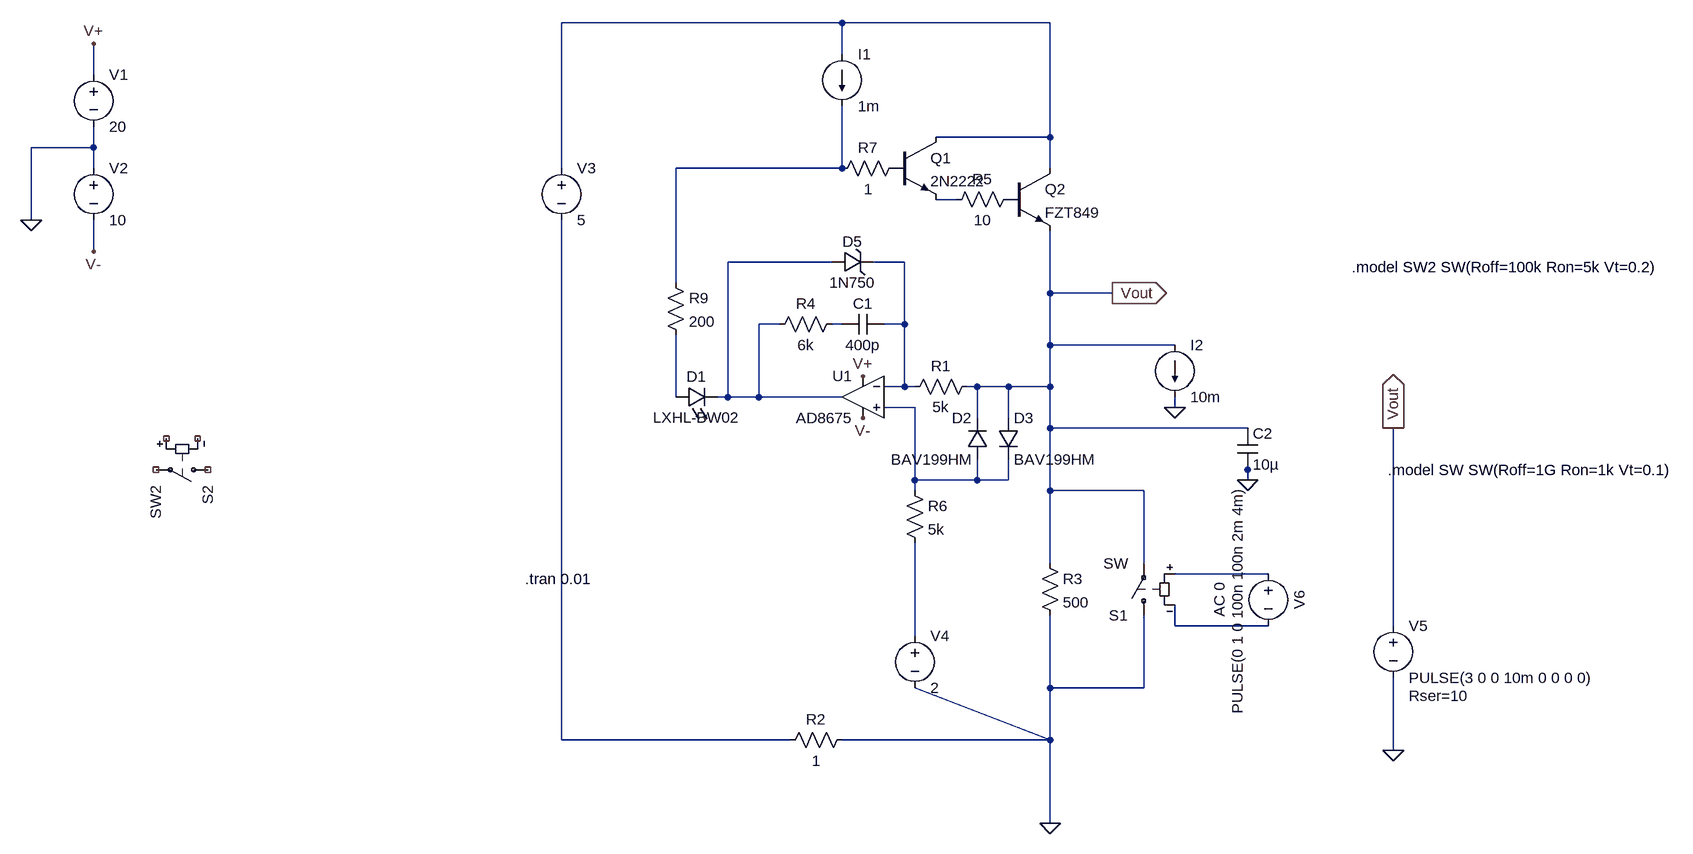
[diagram p0: schematic my_design_from_scratch_test_cv_only.asc]
my_design_from_scratch_test_cv_only.asc, the LTspice schematic file:
Version 4
SHEET 1 1588 1284
WIRE 256 32 -176 32
WIRE 576 32 256 32
WIRE 256 80 256 32
WIRE -896 112 -896 64
WIRE 576 208 576 32
WIRE 576 208 400 208
WIRE -896 224 -896 192
WIRE -896 224 -992 224
WIRE -896 256 -896 224
WIRE -176 256 -176 32
WIRE 256 256 256 160
WIRE 256 256 0 256
WIRE 576 256 576 208
WIRE 432 304 400 304
WIRE -992 336 -992 224
WIRE -896 384 -896 336
WIRE 240 400 80 400
WIRE 352 400 304 400
WIRE 0 432 0 256
WIRE 576 448 576 352
WIRE 672 448 576 448
WIRE 160 496 128 496
WIRE 256 496 240 496
WIRE 352 496 352 400
WIRE 352 496 320 496
WIRE 576 528 576 448
WIRE 768 528 576 528
WIRE 352 592 352 496
WIRE 352 592 320 592
WIRE 368 592 352 592
WIRE 464 592 448 592
WIRE 512 592 464 592
WIRE 576 592 576 528
WIRE 576 592 512 592
WIRE 0 608 0 512
WIRE 80 608 80 400
WIRE 80 608 64 608
WIRE 128 608 128 496
WIRE 128 608 80 608
WIRE 256 608 128 608
WIRE 368 624 320 624
WIRE 768 624 768 608
WIRE 464 640 464 592
WIRE 512 640 512 592
WIRE 576 656 576 592
WIRE 880 656 576 656
WIRE 880 720 880 704
WIRE 368 736 368 624
WIRE 464 736 464 704
WIRE 464 736 368 736
WIRE 512 736 512 704
WIRE 512 736 464 736
WIRE 880 736 880 720
WIRE 368 752 368 736
WIRE 576 752 576 656
WIRE 720 752 576 752
WIRE 576 864 576 752
WIRE 720 864 720 752
WIRE 912 880 768 880
WIRE 768 960 768 928
WIRE 912 960 768 960
WIRE 1104 960 1104 656
WIRE 368 976 368 832
WIRE 576 1056 576 944
WIRE 720 1056 720 944
WIRE 720 1056 576 1056
WIRE -176 1136 -176 336
WIRE 176 1136 -176 1136
WIRE 576 1136 368 1056
WIRE 576 1136 576 1056
WIRE 576 1136 256 1136
WIRE 1104 1152 1104 1040
WIRE 576 1264 576 1136
FLAG -896 64 V+
FLAG -896 384 V-
FLAG 288 576 V+
FLAG 288 640 V-
FLAG 672 448 Vout
IOPIN 672 448 Out
FLAG 576 1264 0
FLAG -992 336 0
FLAG 880 736 0
FLAG 768 624 0
FLAG 1104 656 Vout
IOPIN 1104 656 Out
FLAG 1104 1152 0
SYMBOL voltage -896 96 R0
WINDOW 123 0 0 Left 0
WINDOW 39 0 0 Left 0
SYMATTR InstName V1
SYMATTR Value 20
SYMBOL voltage -896 240 R0
WINDOW 123 0 0 Left 0
WINDOW 39 0 0 Left 0
SYMATTR InstName V2
SYMATTR Value 10
SYMBOL voltage -176 240 R0
WINDOW 123 0 0 Left 0
WINDOW 39 0 0 Left 0
SYMATTR InstName V3
SYMATTR Value 5
SYMBOL res 272 1120 R90
WINDOW 0 0 56 VBottom 2
WINDOW 3 32 56 VTop 2
SYMATTR InstName R2
SYMATTR Value 1
SYMBOL Opamps\\AD8675 288 544 M0
SYMATTR InstName U1
SYMBOL voltage 368 960 R0
WINDOW 123 0 0 Left 0
WINDOW 39 0 0 Left 0
SYMATTR InstName V4
SYMATTR Value 2
SYMBOL npn 512 256 R0
SYMATTR InstName Q2
SYMATTR Value FZT849
SYMBOL cap 320 480 R90
WINDOW 0 0 32 VBottom 2
WINDOW 3 32 32 VTop 2
SYMATTR InstName C1
SYMATTR Value 400p
SYMBOL res 560 848 R0
SYMATTR InstName R3
SYMATTR Value 500
SYMBOL sw 720 960 R180
SYMATTR InstName S1
SYMBOL voltage 912 864 R0
WINDOW 0 32 56 VTop 2
WINDOW 3 -32 56 VBottom 2
WINDOW 123 -60 56 VBottom 2
WINDOW 39 0 0 Left 0
SYMATTR InstName V6
SYMATTR Value PULSE(0 1 0 100n 100n 2m 4m)
SYMATTR Value2 AC 0
SYMBOL cap 864 656 R0
SYMATTR InstName C2
SYMATTR Value 10µ
SYMBOL npn 336 208 R0
SYMATTR InstName Q1
SYMATTR Value 2N2222
SYMBOL current 256 80 R0
WINDOW 123 0 0 Left 0
WINDOW 39 0 0 Left 0
SYMATTR InstName I1
SYMATTR Value 1m
SYMBOL LED 0 624 R270
WINDOW 0 32 32 VTop 2
WINDOW 3 0 32 VBottom 2
SYMATTR InstName D1
SYMATTR Value LXHL-BW02
SYMATTR Description Diode
SYMATTR Type diode
SYMBOL current 768 528 R0
WINDOW 123 0 0 Left 0
WINDOW 39 0 0 Left 0
SYMATTR InstName I2
SYMATTR Value 10m
SYMBOL res 528 288 R90
WINDOW 0 0 56 VBottom 2
WINDOW 3 32 56 VTop 2
SYMATTR InstName R5
SYMATTR Value 10
SYMBOL res 352 240 R90
WINDOW 0 0 56 VBottom 2
WINDOW 3 32 56 VTop 2
SYMATTR InstName R7
SYMATTR Value 1
SYMBOL res -16 416 R0
SYMATTR InstName R9
SYMATTR Value 200
SYMBOL zener 240 416 R270
WINDOW 0 32 32 VTop 2
WINDOW 3 0 32 VBottom 2
SYMATTR InstName D5
SYMATTR Value 1N750
SYMATTR Description Diode
SYMATTR Type diode
SYMBOL sw -704 720 R90
SYMATTR InstName S2
SYMATTR Value SW2
SYMBOL voltage 1104 944 R0
WINDOW 123 0 0 Left 0
WINDOW 39 24 124 Left 2
SYMATTR SpiceLine Rser=10
SYMATTR InstName V5
SYMATTR Value PULSE(3 0 0 10m 0 0 0 0)
SYMBOL res 464 576 R90
WINDOW 0 0 56 VBottom 2
WINDOW 3 32 56 VTop 2
SYMATTR InstName R1
SYMATTR Value 5k
SYMBOL res 256 480 R90
WINDOW 0 0 56 VBottom 2
WINDOW 3 32 56 VTop 2
SYMATTR InstName R4
SYMATTR Value 6k
SYMBOL res 352 736 R0
SYMATTR InstName R6
SYMATTR Value 5k
SYMBOL diode 480 704 R180
WINDOW 0 24 64 Left 2
WINDOW 3 24 0 Left 2
SYMATTR InstName D2
SYMATTR Value BAV199HM
SYMBOL diode 496 640 R0
SYMATTR InstName D3
SYMATTR Value BAV199HM
TEXT -232 888 Left 2 !.tran 0.01
TEXT 1096 720 Left 2 !.model SW SW(Roff=1G Ron=1k Vt=0.1)
TEXT 1040 408 Left 2 !.model SW2 SW(Roff=100k Ron=5k Vt=0.2)

The netlist it stands for:
* my_design_from_scratch_test_cv_only.asc
V1 V+ 0 20
V2 0 V- 10
V3 N001 N012 5
R2 0 N012 1
XU1 N008 N005 V+ V- N004 AD8675  ; pins In+ In- V+ V- OUT
V4 N011 0 2
Q2 N001 P001 Vout 0 FZT849
C1 N005 N006 400p
R3 Vout 0 500
S1 0 Vout N009 N010 SW
V6 N009 N010 PULSE(0 1 0 100n 100n 2m 4m) AC 0
C2 Vout 0 10µ
Q1 N001 P002 N003 0 2N2222
I1 N001 N002 1m
D1 N007 N004 LXHL-BW02
I2 Vout 0 10m
R5 P001 N003 10
R7 P002 N002 1
R9 N002 N007 200
D5 N004 N005 1N750
S2 NC_01 NC_02 NC_03 NC_04 SW2
V5 Vout 0 PULSE(3 0 0 10m 0 0 0 0) Rser=10
R1 Vout N005 5k
R4 N006 N004 6k
R6 N008 N011 5k
D2 N008 Vout BAV199HM
D3 Vout N008 BAV199HM
.model D D
.lib standard.dio
.model NPN NPN
.model PNP PNP
.lib standard.bjt
.tran 0.01
.model SW SW(Roff=1G Ron=1k Vt=0.1)
.model SW2 SW(Roff=100k Ron=5k Vt=0.2)
.backanno
.end